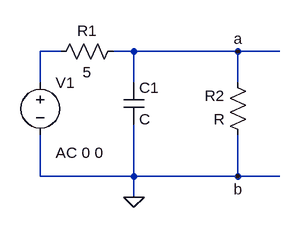
[diagram p0: schematic Draft2.asc]
Draft2.asc, the LTspice schematic file:
Version 4
SHEET 1 880 680
WIRE 176 48 144 48
WIRE 288 48 256 48
WIRE 448 48 288 48
WIRE 512 48 448 48
WIRE 144 96 144 48
WIRE 288 96 288 48
WIRE 448 96 448 48
WIRE 144 240 144 176
WIRE 288 240 288 160
WIRE 288 240 144 240
WIRE 448 240 448 176
WIRE 448 240 288 240
WIRE 512 240 448 240
WIRE 288 272 288 240
FLAG 288 272 0
FLAG 448 48 a
FLAG 448 240 b
SYMBOL voltage 144 80 R0
WINDOW 123 24 124 Left 2
WINDOW 39 0 0 Left 0
SYMATTR InstName V1
SYMATTR Value ""
SYMATTR Value2 AC 0 0
SYMBOL res 272 32 R90
WINDOW 0 0 56 VBottom 2
WINDOW 3 32 56 VTop 2
SYMATTR InstName R1
SYMATTR Value 5
SYMBOL res 464 192 R180
WINDOW 0 36 76 Left 2
WINDOW 3 36 40 Left 2
SYMATTR InstName R2
SYMBOL cap 272 96 R0
SYMATTR InstName C1

The netlist it stands for:
* Draft2.asc
V1 N001 0 AC 0 0
R1 a N001 5
R2 0 a R
C1 a 0 C
.backanno
.end